# EAGLE design ECU (EAGLE 9.6.2)
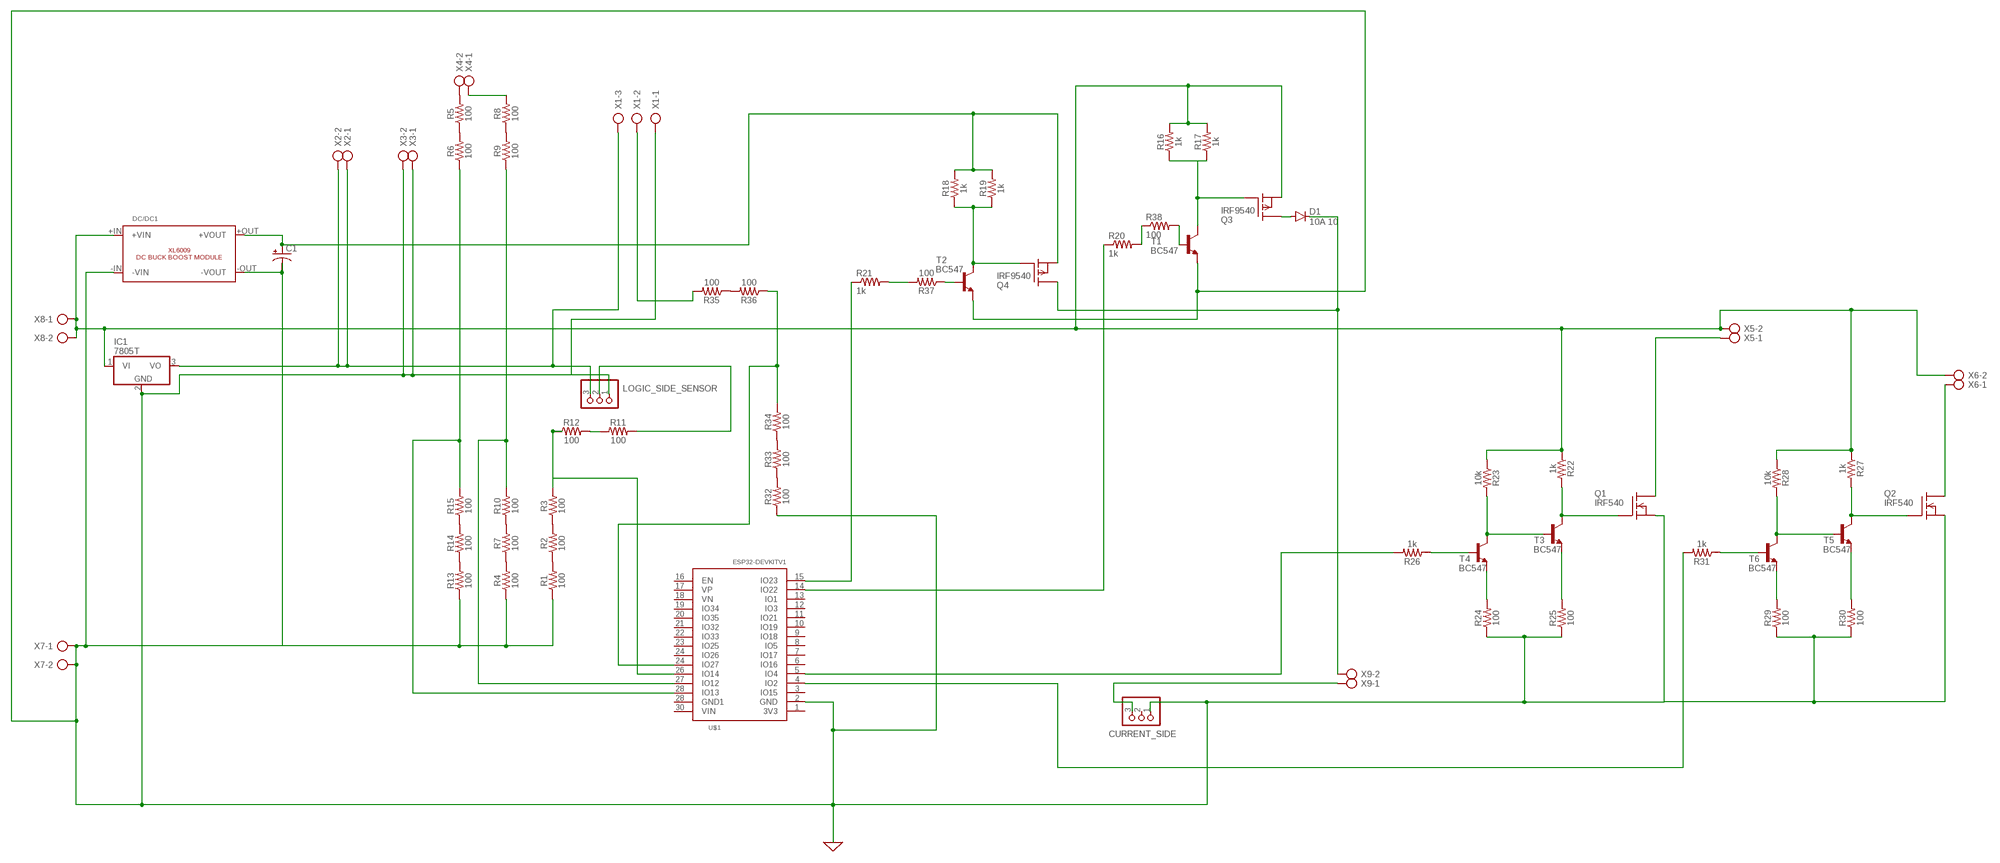
[diagram p0: schematic, sheet 1]

## Parts
C1  CPOL-USE7.5-18  [E7,5-18]
CURRENT_SIDE  PINHD-1X3  [1X03]
D1  10A 10  1N5400  [DO201-15]
DC/DC1  XL6009_DC_BUCK_BOOST_MODULE  [XL6009_DC_BUCK_BOOST_MODULE]
IC1  7805T  [TO220H]
LOGIC_SIDE_SENSOR  PINHD-1X3  [1X03]
Q1  IRF540  [TO220]
Q2  IRF540  [TO220]
Q3  IRF9540  IRF9530  [TO220]
Q4  IRF9540  IRF9530  [TO220]
R1  100  10OHM-HORIZ-1/4W-1%  [AXIAL-0.3]
R2  100  10OHM-HORIZ-1/4W-1%  [AXIAL-0.3]
R3  100  10OHM-HORIZ-1/4W-1%  [AXIAL-0.3]
R4  100  10OHM-HORIZ-1/4W-1%  [AXIAL-0.3]
R5  100  10OHM-HORIZ-1/4W-1%  [AXIAL-0.3]
R6  100  10OHM-HORIZ-1/4W-1%  [AXIAL-0.3]
R7  100  10OHM-HORIZ-1/4W-1%  [AXIAL-0.3]
R8  100  10OHM-HORIZ-1/4W-1%  [AXIAL-0.3]
R9  100  10OHM-HORIZ-1/4W-1%  [AXIAL-0.3]
R10  100  10OHM-HORIZ-1/4W-1%  [AXIAL-0.3]
R11  100  10OHM-HORIZ-1/4W-1%  [AXIAL-0.3]
R12  100  10OHM-HORIZ-1/4W-1%  [AXIAL-0.3]
R13  100  10OHM-HORIZ-1/4W-1%  [AXIAL-0.3]
R14  100  10OHM-HORIZ-1/4W-1%  [AXIAL-0.3]
R15  100  10OHM-HORIZ-1/4W-1%  [AXIAL-0.3]
R16  1k  1KOHM-HORIZ-1/4W-1%  [AXIAL-0.3]
R17  1k  1KOHM-HORIZ-1/4W-1%  [AXIAL-0.3]
R18  1k  1KOHM-HORIZ-1/4W-1%  [AXIAL-0.3]
R19  1k  1KOHM-HORIZ-1/4W-1%  [AXIAL-0.3]
R20  1k  R-US_0207/12  [0207/12]
R21  1k  R-US_0207/12  [0207/12]
R22  1k  1KOHM-HORIZ-1/4W-1%  [AXIAL-0.3]
R23  10k  1KOHM-HORIZ-1/4W-1%  [AXIAL-0.3]
R24  100  10OHM-HORIZ-1/4W-1%  [AXIAL-0.3]
R25  100  10OHM-HORIZ-1/4W-1%  [AXIAL-0.3]
R26  1k  1KOHM-HORIZ-1/4W-1%  [AXIAL-0.3]
R27  1k  1KOHM-HORIZ-1/4W-1%  [AXIAL-0.3]
R28  10k  1KOHM-HORIZ-1/4W-1%  [AXIAL-0.3]
R29  100  10OHM-HORIZ-1/4W-1%  [AXIAL-0.3]
R30  100  10OHM-HORIZ-1/4W-1%  [AXIAL-0.3]
R31  1k  1KOHM-HORIZ-1/4W-1%  [AXIAL-0.3]
R32  100  10OHM-HORIZ-1/4W-1%  [AXIAL-0.3]
R33  100  10OHM-HORIZ-1/4W-1%  [AXIAL-0.3]
R34  100  10OHM-HORIZ-1/4W-1%  [AXIAL-0.3]
R35  100  10OHM-HORIZ-1/4W-1%  [AXIAL-0.3]
R36  100  10OHM-HORIZ-1/4W-1%  [AXIAL-0.3]
R37  100  10OHM-HORIZ-1/4W-1%  [AXIAL-0.3]
R38  100  R-US_0207/12  [0207/12]
T1  BC547  [TO92]
T2  BC547  [TO92]
T3  BC547  [TO92]
T4  BC547  [TO92]
T5  BC547  [TO92]
T6  BC547  [TO92]
U$1  ESP32DEVKITV1  [ESP32-DEVKITV1]
X1  AK300/3  [AK300/3]
X2  AK300/2  [AK300/2]
X3  AK300/2  [AK300/2]
X4  AK300/2  [AK300/2]
X5  AK300/2  [AK300/2]
X6  AK300/2  [AK300/2]
X7  AK300/2  [AK300/2]
X8  AK300/2  [AK300/2]
X9  AK300/2  [AK300/2]

## Nets
0: C1.- CURRENT_SIDE.1 DC/DC1.-IN(-VIN) DC/DC1.-OUT(-VOUT) IC1.2(GND) LOGIC_SIDE_SENSOR.1 Q1.3(S) Q2.3(S) R1.P$1 R4.P$1 R13.P$1 R24.P$1 R25.P$1 R29.P$1 R30.P$1 R32.P$1 T1.1(E) T2.1(E) U$1.2(GND) X1.1 X3.1 X3.2 X7.1 X7.2 ; supply symbol labelled GND
N$1: Q2.2(D) X6.1
N$2: R38.2 T1.2(B)
N$3: Q1.2(D) X5.1
N$4: R23.P$2 T3.2(B) T4.3(C)
N$5: CURRENT_SIDE.3 X9.1
N$6: R8.P$1 R9.P$2
N$7: IC1.3(VO) LOGIC_SIDE_SENSOR.3 X1.3 X2.1 X2.2
N$8: D1.C Q4.2(D) X9.2
N$9: R6.P$1 R15.P$2 U$1.28(IO13)
N$10: R4.P$2 R7.P$1
N$11: R7.P$2 R10.P$1
N$12: R1.P$2 R2.P$1
N$13: R5.P$2 X4.2
N$14: R5.P$1 R6.P$2
N$15: R9.P$1 R10.P$2 U$1.27(IO12)
N$16: R8.P$2 X4.1
N$17: LOGIC_SIDE_SENSOR.2 R11.P$2
N$18: R11.P$1 R12.P$2
N$19: R2.P$2 R3.P$1
N$20: R3.P$2 R12.P$1 U$1.26(IO14)
N$21: R28.P$2 T5.2(B) T6.3(C)
N$22: R13.P$2 R14.P$1
N$23: R14.P$2 R15.P$1
N$24: D1.A Q3.2(D)
N$25: R24.P$2 T4.1(E)
N$26: Q3.1(G) R16.P$1 R17.P$1 T1.3(C)
N$27: C1.+ DC/DC1.+OUT(+VOUT) Q4.3(S) R18.P$2 R19.P$2
N$28: Q4.1(G) R18.P$1 R19.P$1 T2.3(C)
N$29: Q1.1(G) R22.P$2 T3.3(C)
N$30: R21.2 R37.P$2
N$31: R21.1 U$1.15(IO23)
N$32: R25.P$2 T3.1(E)
N$33: R20.1 U$1.14(IO22)
N$34: R26.P$1 T4.2(B)
N$35: Q2.1(G) R27.P$2 T5.3(C)
N$36: DC/DC1.+IN(+VIN) IC1.1(VI) Q3.3(S) R16.P$2 R17.P$2 R22.P$1 R23.P$1 R27.P$1 R28.P$1 X5.2 X6.2 X8.1 X8.2
N$37: R29.P$2 T6.1(E)
N$38: R30.P$2 T5.1(E)
N$39: R37.P$1 T2.2(B)
N$40: R31.P$1 T6.2(B)
N$41: R31.P$2 U$1.4(IO2)
N$42: R26.P$2 U$1.5(IO4)
N$43: R20.2 R38.1
N$44: R32.P$2 R33.P$1
N$45: R33.P$2 R34.P$1
N$46: R35.P$1 R36.P$2
N$47: R34.P$2 R36.P$1 U$1.24(IO27)
N$48: R35.P$2 X1.2
Unconnected: CURRENT_SIDE.2 U$1.1(3V3) U$1.3(IO15) U$1.6(IO16) U$1.7(IO17) U$1.8(IO5) U$1.9(IO18) U$1.10(IO19) U$1.11(IO21) U$1.12(IO3) U$1.13(IO1) U$1.16(EN) U$1.17(VP) U$1.18(VN) U$1.19(IO34) U$1.20(IO35) U$1.21(IO32) U$1.22(IO33) U$1.23(IO25) U$1.24(IO26) U$1.28(GND1) U$1.30(VIN)

## Library data of the parts
C1 = rcl:CPOL-US: POLARIZED CAPACITOR, American symbol; SPICEPREFIX: C
CURRENT_SIDE LOGIC_SIDE_SENSOR = pinhead:PINHD-1X3: PIN HEADER
D1 = diode:1N5400: DIODE standard rectifier, 3 A, 50 V (Motorola)
DC/DC1 = DC Module:XL6009_DC_BUCK_BOOST_MODULE
IC1 = linear:78*: Positive VOLTAGE REGULATOR Source: http://cache.national.com/ds/LM/LM78L05.pdf http://www.fairchildsemi.com/ds/LM/LM7805.pdf
Q1 Q2 = transistor-fet:IRF540: N-Channel Enhancement MOSFET (HEXFET); 100V; 28A; 0,077Ohm
Q3 Q4 = transistor-fet:IRF9530: P-Channel Enhancement MOSFET (HEXFET); -100V; -12A; 0,3Ohm
R1-R15 R24 R25 R29 R30 R32-R37 = SparkFun-Resistors:10OHM: 10Ω resistor A resistor is a passive two-terminal electrical component that implements electrical resistance as a circuit element. Resistors act to reduce current flow, and, at the same time, act to lower voltage levels within circuits. - Wikipedia; PROD_ID: RES-12180; VALUE: 10
R16-R19 R22 R26 R27 R31 = SparkFun-Resistors:1KOHM: 1kΩ resistor A resistor is a passive two-terminal electrical component that implements electrical resistance as a circuit element. Resistors act to reduce current flow, and, at the same time, act to lower voltage levels within circuits. - Wikipedia; PROD_ID: RES-12182
R20 R21 R38 = adafruit:R-US_: RESISTOR, American symbol
R23 R28 = SparkFun-Resistors:1KOHM: 1kΩ resistor A resistor is a passive two-terminal electrical component that implements electrical resistance as a circuit element. Resistors act to reduce current flow, and, at the same time, act to lower voltage levels within circuits. - Wikipedia; PROD_ID: RES-12182; VALUE: 1k
T1-T6 = transistor:BC547: NPN TRANSISTOR
U$1 = ESP32-DEVKITV1:ESP32DEVKITV1
X1 = con-ptr500:AK300/3: CONNECTOR; OC_FARNELL: unknown; OC_NEWARK: unknown
X2-X9 = con-ptr500:AK300/2: CONNECTOR; OC_FARNELL: unknown; OC_NEWARK: unknown

## Board
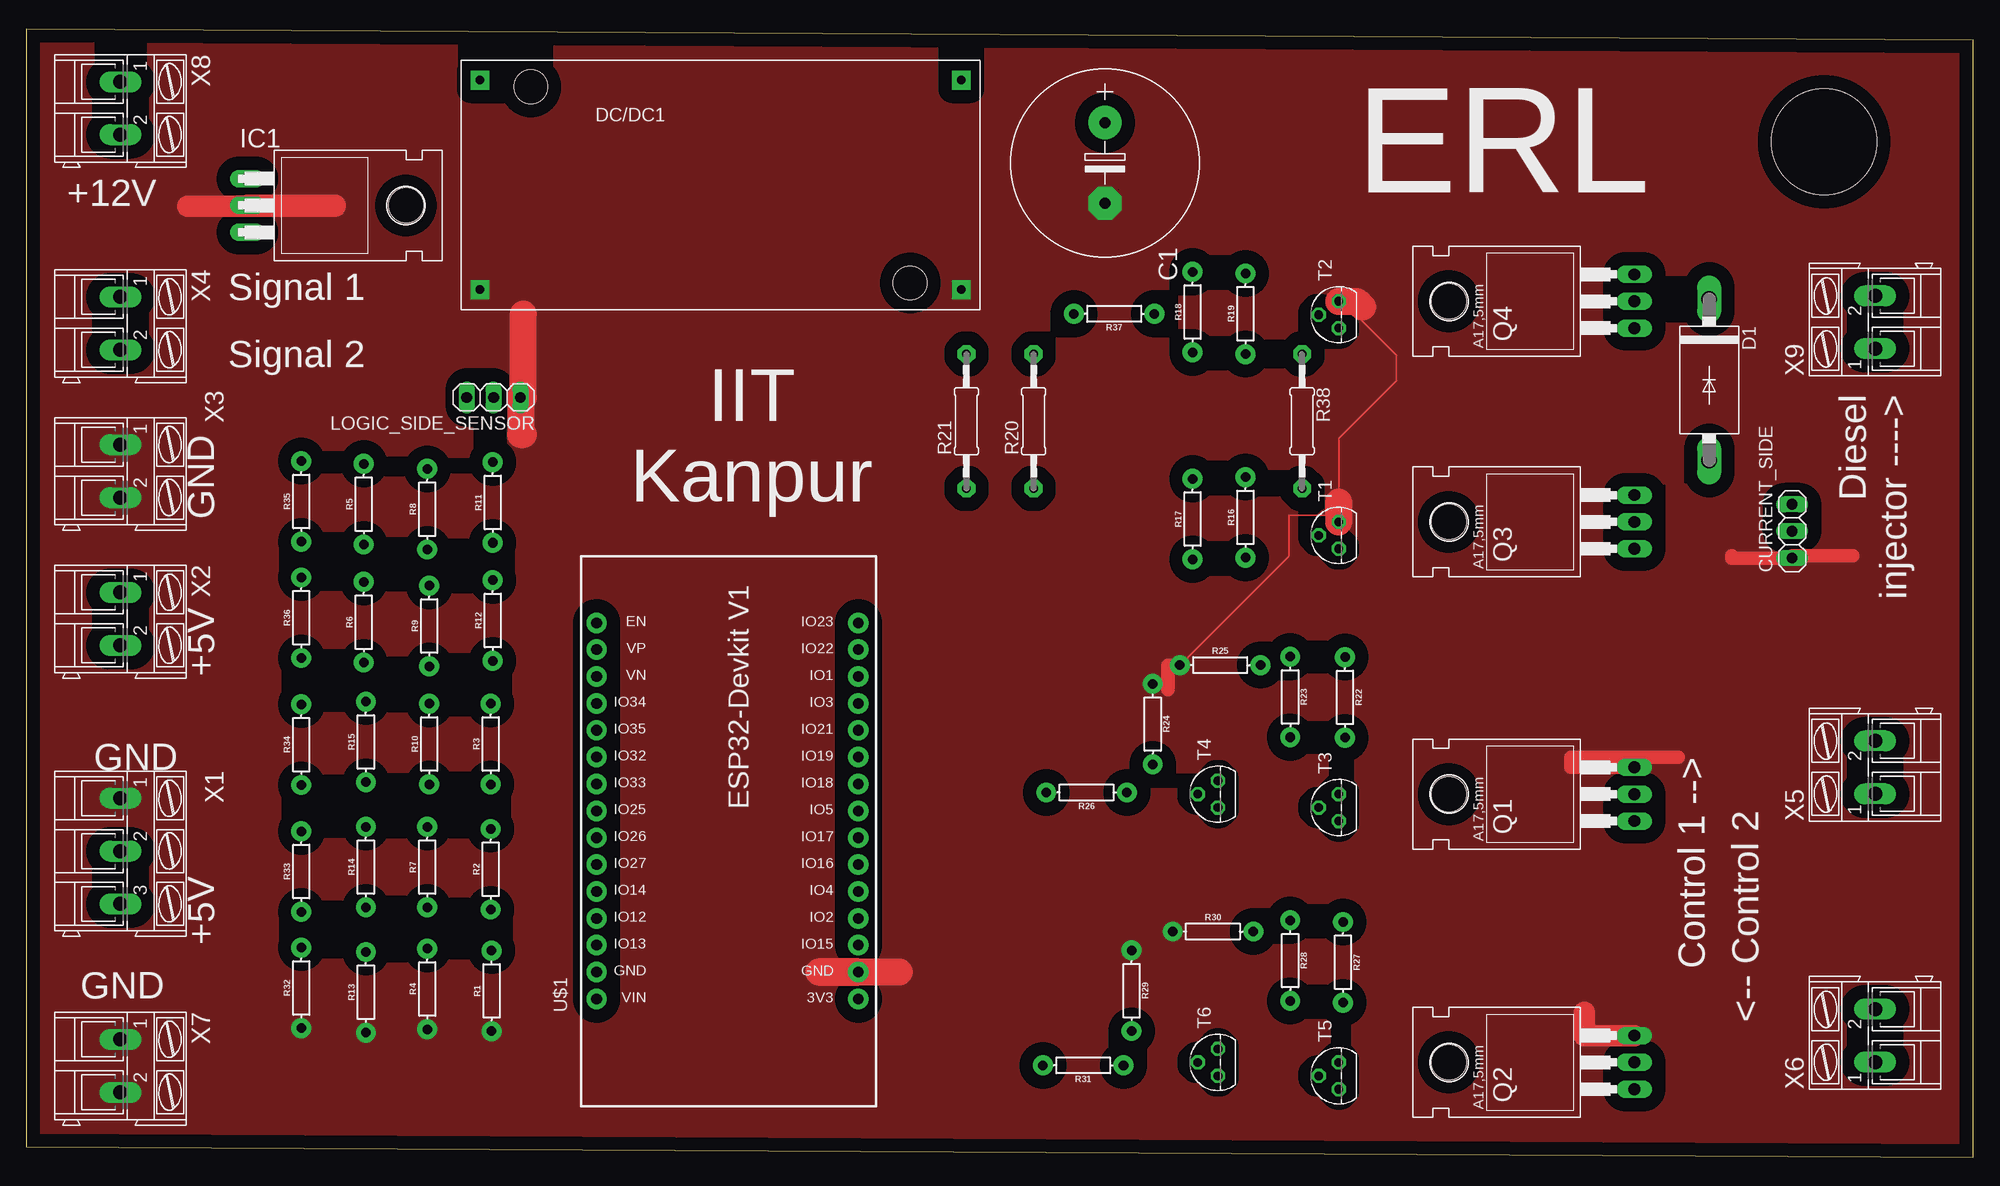
[diagram p1: board, top side]
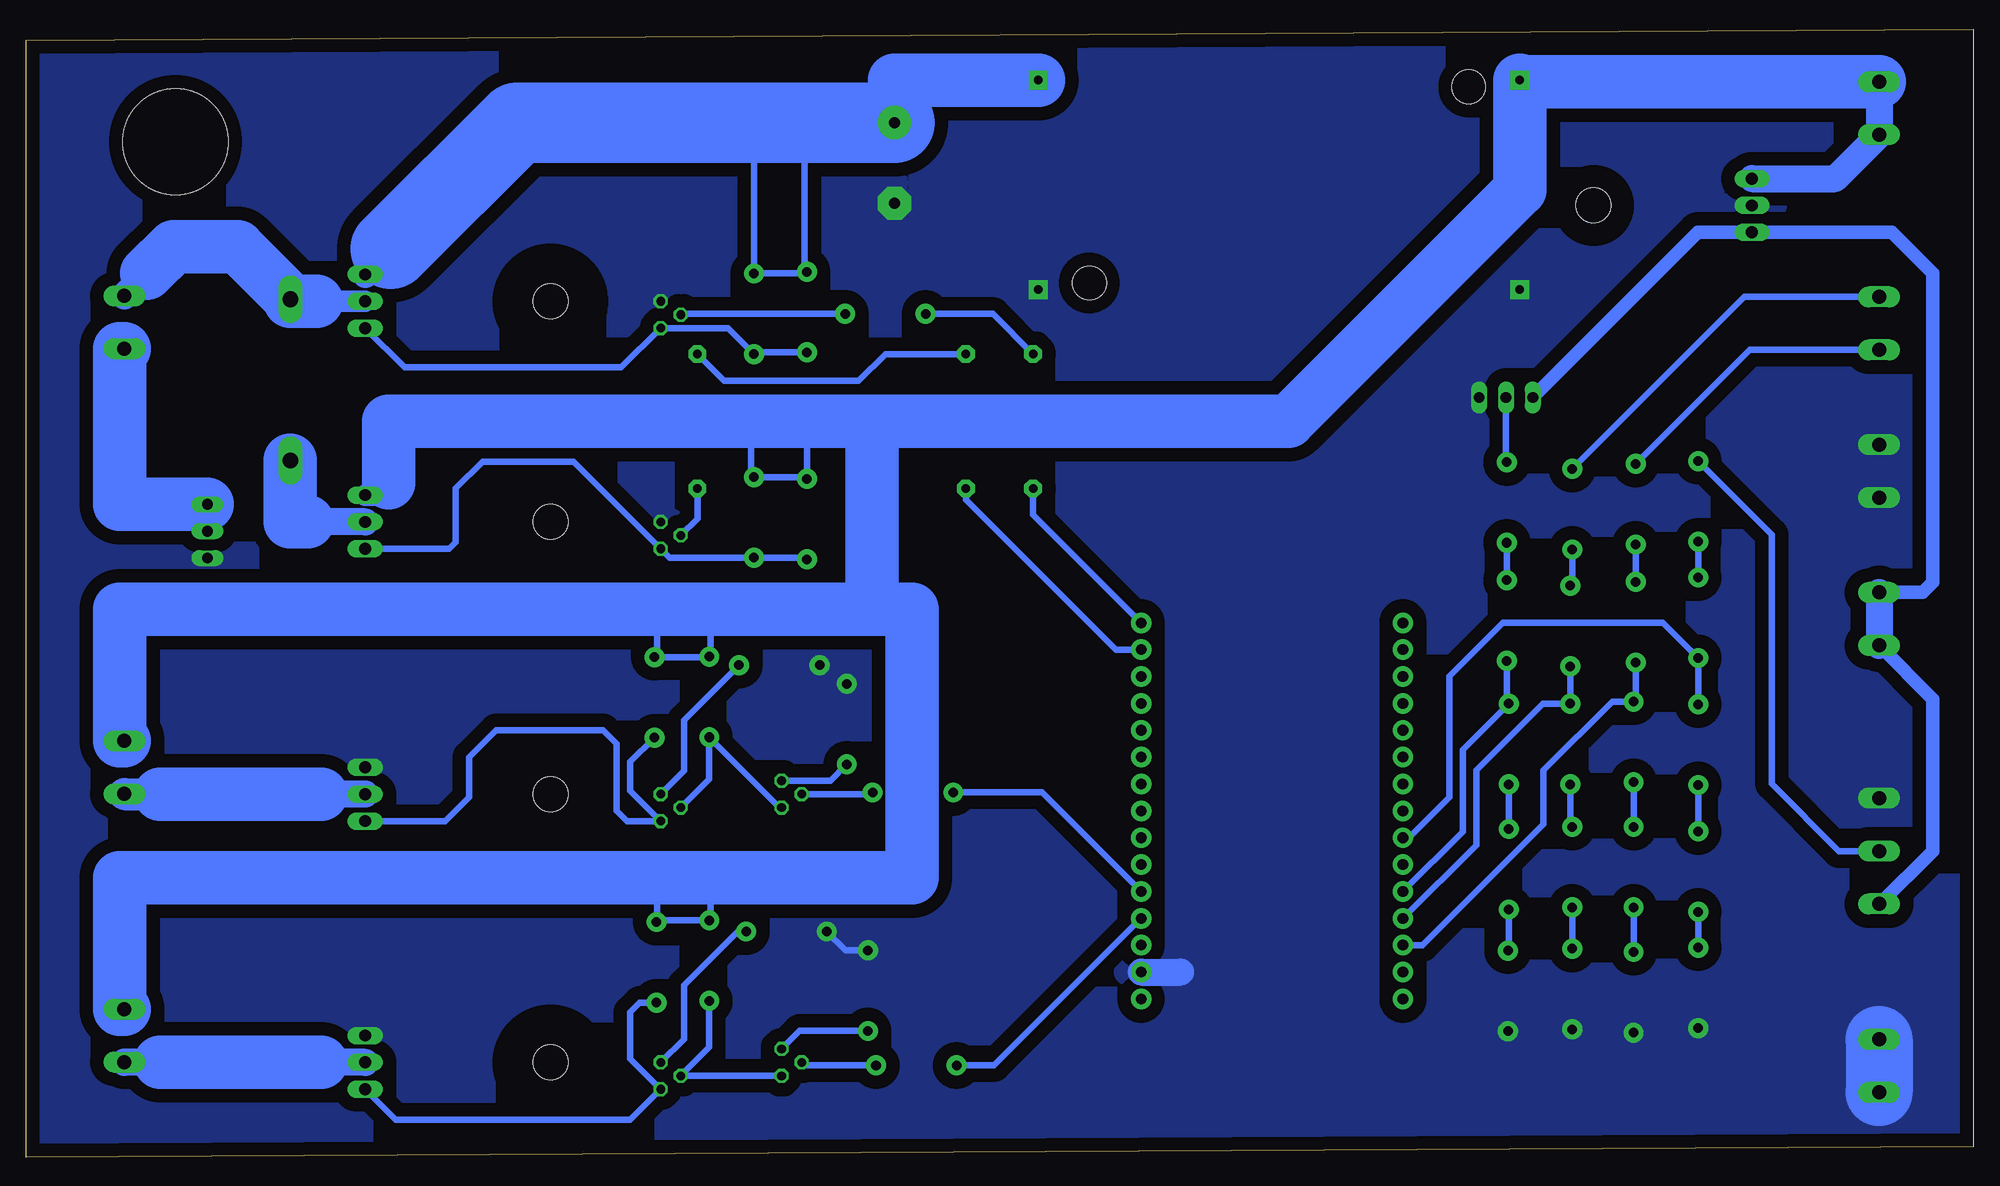
[diagram p2: board, bottom side, seen from below]

Size 184.1 x 106.62 mm. Coordinates in mm from the lower left corner, seen from the top.
Outline: 0,1 184.1,0 184.1,105.62 0,106.62 0,1
Copper layers (1*16): Top 0.035mm / dielectric 1.5mm / Bottom 0.035mm
Design rules "default": minimum track width 6mil, minimum drill 0.35mm, track to track 6mil, track to pad 6mil, pad to pad 6mil, via to via 6mil, smd to smd 6mil, copper to edge 40mil, drill to drill 6mil, minimum pad ring 10mil, minimum via ring 8mil, stop-mask expansion 4mil, vias tented up to drill 0mil, thermal gap 10mil
Holes 10 mm at 170,96

### Footprints (pad centres in the part's own frame; a part is rotated, then mirrored left to right if it is on the bottom)
E7,5-18 = drill 1.016 pad 3.15: + -3.81,0 | drill 1.016 pad 3.15 octagon: - 3.81,0
1X03 = drill 1.016 long: 1 -2.54,0; 2 0,0; 3 2.54,0
DO201-15 = drill 1.499 long: A 7.62,0; C -7.62,0
XL6009_DC_BUCK_BOOST_MODULE = drill 0.8 pad 1.778 square: +IN 1.778,19.177; +OUT 47.307,19.177; -IN 1.778,-0.635; -OUT 47.307,-0.635 | hole 3.2: 6.604,18.542; 42.481,0
TO220H = drill 1.118 long: 1 -2.54,-10.16; 2 0,-10.16; 3 2.54,-10.16 | hole 3.302: 0,4.826
TO220 = drill 1.118 long: 1 -2.54,-6.35; 2 0,-6.35; 3 2.54,-6.35 | hole 3.302: 0,11.176
AXIAL-0.3 = drill 0.9 pad 1.88: P$1 -3.81,0; P$2 3.81,0
0207/12 = drill 0.813 pad 1.676 octagon: 1 -6.35,0; 2 6.35,0
TO92 = drill 0.813 octagon: 1 1.27,0; 2 0,1.905; 3 -1.27,0
ESP32-DEVKITV1 = drill 1 pad 1.93: 1 -22.87,-13.54; 2 -20.33,-13.54; 3 -17.79,-13.54; 4 -15.25,-13.54; 5 -12.71,-13.54; 6 -10.17,-13.54; 7 -7.63,-13.54; 8 -5.09,-13.54; 9 -2.55,-13.54; 10 -0.01,-13.54; 11 2.53,-13.54; 12 5.07,-13.54; 13 7.61,-13.54; 14 10.15,-13.54; 15 12.69,-13.54; 16 12.69,11.23; 17 10.15,11.23; 18 7.61,11.23; 19 5.07,11.23; 20 2.53,11.23; 21 -0.01,11.23; 22 -2.55,11.23; 23 -5.09,11.23; 24 -7.63,11.23; 25 -10.17,11.23; 26 -12.71,11.23; 27 -15.25,11.23; 28 -17.79,11.23; 29 -20.33,11.23; 30 -22.87,11.23
AK300/3 = drill 1.321 long: 1 -5.004,0; 2 0,0; 3 5.004,0
AK300/2 = drill 1.321 long: 1 -2.515,0; 2 2.489,0

### Placement (x,y rotation side)
C1  102,94 270 top
CURRENT_SIDE  166.99,59.18 90 top
D1  159.14,73.49 270 top
DC/DC1  41.1,82.65 0 top
IC1  31.07,89.98 270 top
LOGIC_SIDE_SENSOR  44.18,71.83 180 top
Q1  145.71,34.32 90 top
Q2  145.71,8.96 90 top
Q3  145.71,60.06 90 top
Q4  145.71,80.92 90 top
R1  43.99,15.72 90 top
R2  43.91,27.22 90 top
R3  43.91,39.06 90 top
R4  37.91,15.9 90 top
R5  31.91,61.74 90 top
R6  31.91,50.58 90 top
R7  37.91,27.42 90 top
R8  37.91,61.26 90 top
R9  38.1,50.22 90 top
R10  38.1,39.06 90 top
R11  44.1,61.9 90 top
R12  44.1,50.74 90 top
R13  32.1,15.58 90 top
R14  32.1,27.42 90 top
R15  32.1,39.26 90 top
R16  115.29,60.49 90 top
R17  110.29,60.33 90 top
R18  110.29,79.9 90 top
R19  115.29,79.74 90 top
R20  95.25,69.58 90 top
R21  88.9,69.58 90 top
R22  124.71,43.47 270 top
R23  119.52,43.51 270 top
R24  106.52,40.94 270 top
R25  112.9,46.52 0 top
R26  100.26,34.48 180 top
R27  124.52,18.42 270 top
R28  119.52,18.58 270 top
R29  104.52,15.74 270 top
R30  112.22,21.33 0 top
R31  99.94,8.67 180 top
R32  26,16 90 top
R33  26,27 90 top
R34  26,39 90 top
R35  26,62 90 top
R36  26,51 90 top
R37  102.87,79.74 180 top
R38  120.65,69.58 270 top
T1  124.12,58.79 90 top
T2  124.12,79.65 90 top
T3  124.12,33.05 90 top
T4  112.69,34.32 90 top
T5  124.12,7.69 90 top
T6  112.69,8.96 90 top
U$1  65.15,37.83 90 top
X1  8.89,28.94 270 top
X2  8.89,50.88 270 top
X3  8.89,64.85 270 top
X4  8.89,78.82 270 top
X5  174.84,36.86 90 top
X6  174.84,11.5 90 top
X7  8.89,8.62 270 top
X8  8.89,99.16 270 top
X9  174.84,78.95 90 top

### Tracks (layer width: path | path; a pad name or v marks a point on that pad's centre or on a via)
0
  Top 0.152: R25.P$1 119.38,56.81 119.38,60.69 123.49,60.69 T1.1 | 124.46,80.92 125.82,80.92 | 126.36,80.38 127,79.74 | 124.12,61.96 124.12,67.97 129.54,73.39 129.54,75.84 124.46,80.92 | T2.1 124.46,80.92
  Top 1.27: Q1.3 146.05,36.86 146.05,37.83 156.21,37.83 | 161.29,56.88 161.29,56.64 CURRENT_SIDE.1 166.99,56.88 172.72,56.88 | R25.P$1 107.95,46.52 107.95,44.18
  Top 2.032: IC1.2 29.21,89.98 29.21,89.9 15.24,89.9 | Q2.3 147.32,11.5 147.32,13.7
  Top 2.54: U$1.2 74.93,17.51 74.93,17.5 U$1.2 | U$1.2 82.55,17.51 | 46.99,79.74 46.99,71.83 LOGIC_SIDE_SENSOR.1 46.72,68.31 46.99,68.31 | T2.1 125.82,80.92 126.36,80.38 | T1.1 124.12,61.96
  Bottom 0.61: R29.P$1 106.63,19.55 R30.P$1
  Bottom 2.54: U$1.2 74.94,17.5 74.93,17.51
  Bottom 6.35: X7.1 X7.2
  pour Bottom (isolate 1.27): 0,1 184.15,1 184.15,106.41 0,106.41
  pour Top (isolate 1.27): 0,1 184.15,1 184.15,106.41 0,106.41
N$1
  Bottom 2.54: Q2.2 156.21,8.96 | 171.45,8.96 174.84,8.96 X6.1
  Bottom 5.08: 156.21,8.96 171.45,8.96
N$2
  Bottom 0.61: T1.2 120.65,60.35 R38.2
N$3
  Bottom 2.032: Q1.2 174.84,34.32
  Bottom 2.54: 174.84,34.32 X5.1 | Q1.2 158.75,34.32
  Bottom 3.048: 174.84,34.32 171.45,34.32
  Bottom 5.08: 171.45,34.32 158.75,34.32 156.21,34.32
N$4
  Bottom 0.61: T4.3 112.87,33.05 R23.P$2 119.52,35.74 T3.2
N$5
  Bottom 5.08: CURRENT_SIDE.3 175.26,61.72 175.26,76.44 X9.1
N$6
  Bottom 0.61: R8.P$1 37.91,54.03 R9.P$2
N$7
  Bottom 1.27: X2.2 3.81,43.31 3.81,28.94 8.81,23.94 X1.3 | X2.1 4.75,53.4 3.81,54.34 3.81,83.55 7.7,87.44 IC1.3 26.03,87.44 LOGIC_SIDE_SENSOR.3
  Bottom 2.54: X2.1 X2.2
N$8
  Bottom 2.032: 154.94,80.92 Q4.2 158.95,80.92 D1.C
  Bottom 2.54: 172.72,83.56 X9.2
  Bottom 5.08: 156.63,80.92 159.14,80.92 D1.C 164.12,86.09 170.19,86.09 172.72,83.56
N$9
  Bottom 0.61: R6.P$1 31.91,43.07 R15.P$2 34.13,43.07 40.64,36.56 40.64,31.48 52.08,20.04 U$1.28
N$10
  Bottom 0.61: R4.P$2 R7.P$1
N$11
  Bottom 0.61: R10.P$1 38.1,31.23 R7.P$2
N$12
  Bottom 0.61: R2.P$1 43.91,19.53 R1.P$2
N$13
  Bottom 0.61: R5.P$2 21.13,76.33 X4.2
N$14
  Bottom 0.61: R5.P$1 R6.P$2
N$15
  Bottom 0.61: R9.P$1 R10.P$2 40.68,42.87 46.99,36.56 46.99,29.51 U$1.27
N$16
  Bottom 0.61: R8.P$2 21.64,81.33 X4.1
N$17
  Bottom 0.61: LOGIC_SIDE_SENSOR.2 44.18,65.71 R11.P$2
N$18
  Bottom 0.61: R11.P$1 R12.P$2
N$19
  Bottom 0.61: R3.P$1 R2.P$2
N$20
  Bottom 0.61: R12.P$1 44.1,42.87 R3.P$2 48.26,38.52 48.26,30.78 U$1.26
N$21
  Bottom 0.61: T6.3 T5.2 119.52,10.38 R28.P$2
N$22
  Bottom 0.61: R14.P$1 R13.P$2
N$23
  Bottom 0.61: R15.P$1 R14.P$2
N$24
  Bottom 2.032: 157.48,60.06 156.21,60.06
  Bottom 2.54: Q3.2 156.21,60.06
  Bottom 5.08: D1.A 159.14,60.06 157.48,60.06
N$25
  Bottom 0.61: R24.P$2 108.06,35.59 T4.1
N$26
  Bottom 0.61: R17.P$1 110.45,56.68 R16.P$1 123.28,56.68 T1.3 132.37,65.77 140.97,65.77 143.51,63.23 143.51,58.15 144.14,57.52 Q3.1
N$27
  Bottom 0.61: 110.45,83.55 R19.P$2 115.29,97.53 115.57,97.81 | 110.45,83.55 R18.P$2 | 110.49,97.81 110.49,83.59 110.45,83.55
  Bottom 2.54: 149.65,85.88 Q4.3
  Bottom 5.08: DC/DC1.+OUT 102,101.83 C1.+
  Bottom 7.62: C1.+ 110.49,97.81 115.57,97.81 137.71,97.81 149.65,85.88
N$28
  Bottom 0.61: R18.P$1 115.13,76.09 R19.P$1 117.74,78.38 T2.3 127.84,74.66 148.34,74.66 Q4.1
N$29
  Bottom 0.61: R22.P$2 127,37.37 127,34.66 T3.3 127.3,31.78 128.27,32.75 128.27,39.1 129.54,40.37 139.7,40.37 142.24,37.83 142.24,34.02 144.48,31.78 Q1.1 151.76,31.48
N$30
  Bottom 0.61: 98.06,79.74 R37.P$2 92.71,79.74 R21.2
N$31
  Bottom 0.61: U$1.15 88.9,60.73 R21.1
N$32
  Bottom 0.61: R25.P$2 121.92,41.31 121.92,36.52 T3.1
N$33
  Bottom 0.61: U$1.14 81.08,47.98 95.25,62.15 R20.1
N$34
  Bottom 0.61: R26.P$1 104.23,34.32 T4.2
N$35
  Bottom 0.61: Q2.1 149.18,3.54 127,3.54 T5.3 127,9.3 127,13.7 126.09,14.61 R27.P$2
N$36
  Bottom 0.61: 119.38,26.4 119.38,22.53 R28.P$1 124.36,22.39 R27.P$1 124.46,22.29 124.46,25.13 | 119.38,51.8 119.38,47.46 R23.P$1 119.56,47.28 R22.P$1 124.46,47.53 124.46,51.8 | 115.57,69.58 115.57,64.58 R16.P$2 110.45,64.3 R17.P$2 110.29,69.38 110.49,69.58
  Bottom 2.032: Q3.3 149.86,62.6 149.86,63.77
  Bottom 2.54: X8.1 X8.2 13.04,92.52 IC1.1
  Bottom 5.08: X8.1 42.73,101.67 DC/DC1.+IN 42.88,91.47 64.77,69.58 104.14,69.58 | 104.14,51.8 104.14,69.58 | 104.14,51.8 119.38,51.8 124.46,51.8 175.26,51.8 175.26,39.35 X5.2 | 104.14,51.8 100.33,51.8 100.33,26.4 119.38,26.4 175.26,26.4 175.26,13.99 X6.2 | 104.14,69.58 110.49,69.58 115.57,69.58 149.86,69.58 149.86,63.77
N$37
  Bottom 0.61: R29.P$2 110.99,11.93 T6.1
N$38
  Bottom 0.61: T5.1 121.92,11.16 121.92,16.24 116.83,21.33 R30.P$2
N$39
  Bottom 0.61: R37.P$1 122.12,79.74 T2.2
N$40
  Bottom 0.61: R31.P$1 110.5,8.67 T6.2
N$41
  Bottom 0.61: U$1.4 92.6,8.67 R31.P$2
N$42
  Bottom 0.61: U$1.5 88.05,34.48 R26.P$2
N$43
  Bottom 0.61: R20.2 102.87,75.93 105.41,73.39 118.11,73.39 R38.1
N$44
  Bottom 0.61: R32.P$2 R33.P$1
N$45
  Bottom 0.61: R34.P$1 R33.P$2
N$46
  Bottom 0.61: R35.P$1 R36.P$2
N$47
  Bottom 0.61: R34.P$2 R36.P$1 29.34,50.53 44.45,50.53 49.53,45.45 49.53,34.02 53.35,30.2 U$1.24
N$48
  Bottom 0.61: X1.2 12.7,28.94 19.05,35.29 19.05,58.15 19.05,58.86 R35.P$2

### Text on the board
tNames: ERL | +12V | Signal 1 | Signal 2 | Diesel / injector ----> | GND | IIT / Kanpur | +5V | Control 1 --> | GND | <-- Control 2 | +5V | GND